# EAGLE design esp_prog (EAGLE 9.6.2)
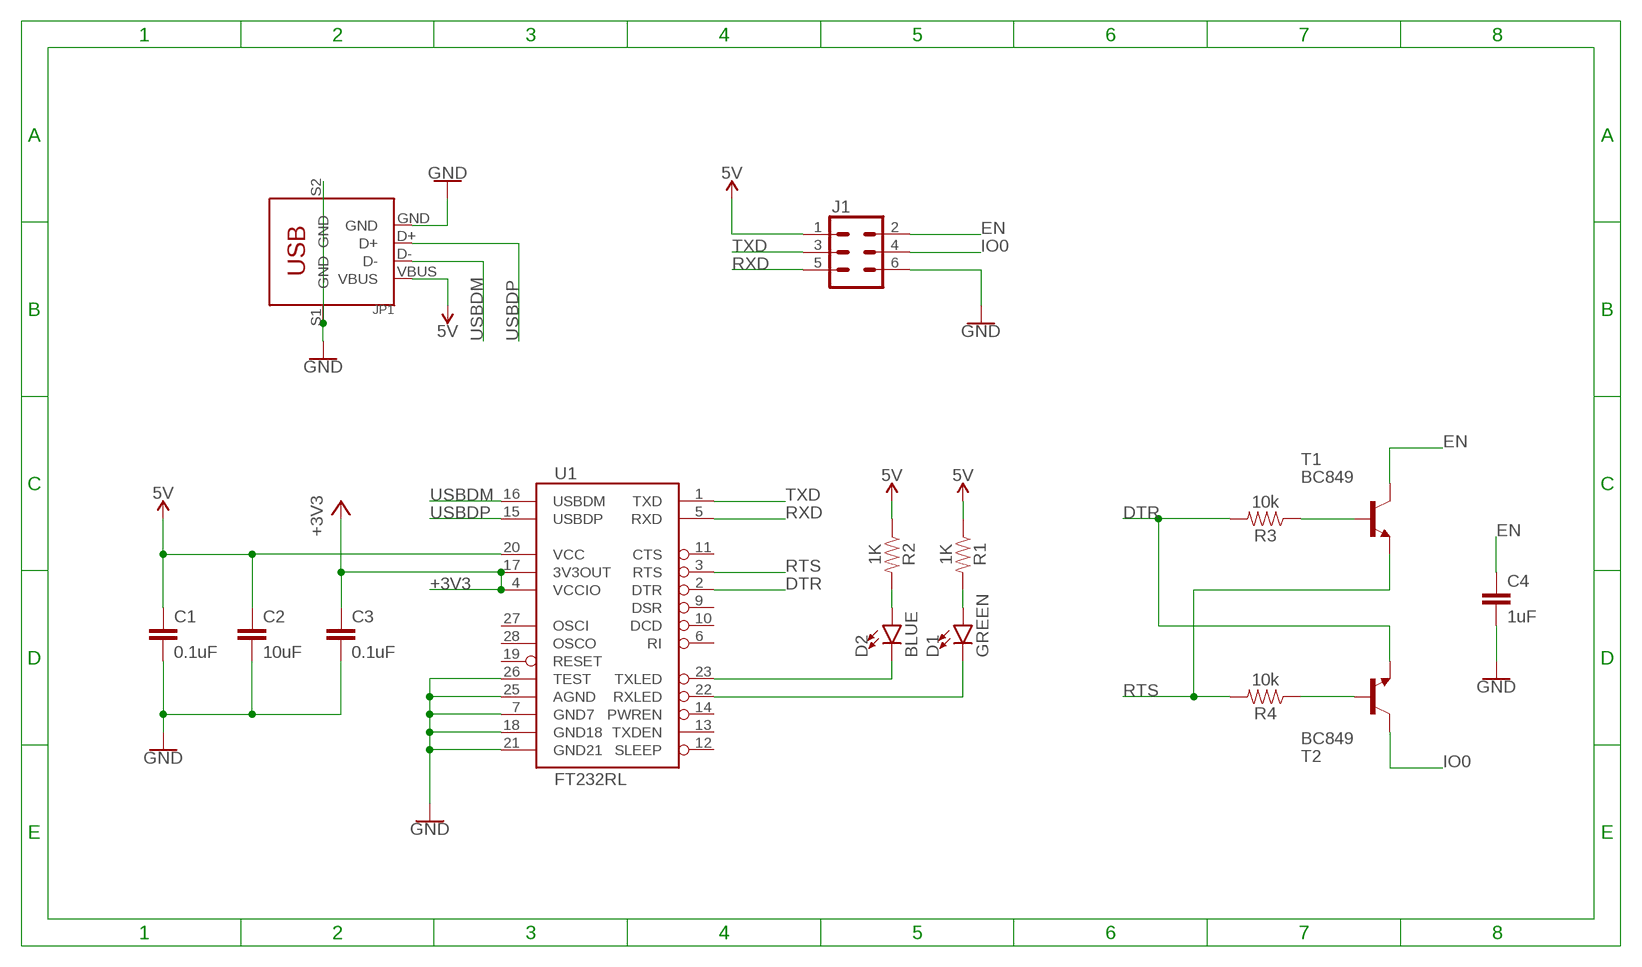
[diagram p0: schematic, sheet 1]

## Parts
C1  0.1uF  0.1UF-0603-25V-(+80/-20%)  [0603]
C2  10uF  10UF-0603-6.3V-20%  [0603]
C3  0.1uF  0.1UF-0603-25V-(+80/-20%)  [0603]
C4  1uF  10UF-0603-6.3V-20%  [0603]
D1  GREEN  LED-GREEN0603  [LED-0603]
D2  BLUE  LED-BLUE0603  [LED-0603]
J1  CONN_03X2SHROUD  [2X3-SHROUDED]
JP1  DIP-USB-B-TYPE-FMAL(4+2P-2.0-90D)  [USB4+2-2.5-90D-15.8X12MM]
R1  1K  RESISTOR0603  [0603]
R2  1K  RESISTOR0603  [0603]
R3  10k  RESISTOR0603  [0603]
R4  10k  RESISTOR0603  [0603]
T1  BC849  [SOT23]
T2  BC849  [SOT23]
U1  FT232RL  FT232RLSSOP  [SSOP28DB]

## Nets
5V: C1.1 C2.1 J1.1 JP1.VBUS R1.1 R2.1 U1.20(VCC)
+3V3: C3.1 U1.4(VCCIO) U1.17(3V3OUT)
DTR: R3.2 T2.2(E) U1.2(DTR)
EN: C4.1 J1.2 T1.3(C)
GND: C1.2 C2.2 C3.2 C4.2 J1.6 JP1.GND JP1.S1(GND) JP1.S2(GND) U1.7(GND7) U1.18(GND18) U1.21(GND21) U1.25(AGND) U1.26(TEST)
IO0: J1.4 T2.3(C)
N$1: D2.C U1.23(TXLED)
N$2: D1.C U1.22(RXLED)
N$3: D2.A R2.2
N$4: D1.A R1.2
N$5: R4.1 T2.1(B)
N$10: R3.1 T1.1(B)
RTS: R4.2 T1.2(E) U1.3(RTS)
RXD: J1.5 U1.5(RXD)
TXD: J1.3 U1.1(TXD)
USBDM: JP1.D- U1.16(USBDM)
USBDP: JP1.D+ U1.15(USBDP)
Unconnected: U1.6(RI) U1.9(DSR) U1.10(DCD) U1.11(CTS) U1.12(SLEEP) U1.13(TXDEN) U1.14(PWREN) U1.19(RESET) U1.27(OSCI) U1.28(OSCO)

## Library data of the parts
C1 C3 = SparkFun-Capacitors:0.1UF: 0.1µF ceramic capacitors A capacitor is a passive two-terminal electrical component used to store electrical energy temporarily in an electric field.; PROD_ID: CAP-00810
C2 = SparkFun-Capacitors:10UF: 10.0µF ceramic capacitors A capacitor is a passive two-terminal electrical component used to store electrical energy temporarily in an electric field.; PROD_ID: CAP-11015
C4 = SparkFun-Capacitors:10UF: 10.0µF ceramic capacitors A capacitor is a passive two-terminal electrical component used to store electrical energy temporarily in an electric field.; PROD_ID: CAP-11015; VALUE: 10uF
D1 = SparkFun-LED:LED-GREEN: Green SMD LED Used in manufacturing of various products at SparkFun Packages: 0603 - SMD 0603 package [Product Link] <http://www.futureelectronics.com/en/technologies/semiconductors/optoelectronics/leds/Pages/9894312-LTST-C190GKT.aspx?CrossPart=HSMG-C190&IM=0> LilyPad 1206 - SMD1206 LilyPad package [Product Link] <http://www.futureelectronics.com/en/Technologies/Product.aspx?ProductID=IN150NGHARVATEKCORPORATION2049943&IM=0> 1206 - SMD1206 package [Product Link] <http://www.futureelectronics.com/en/technologies/semiconductors/optoelectronics/leds/Pages/8315665-LTST-C150KGKT.aspx?IM=0> 1206 Bottom Mount -SMD 1206 Bottom Mount [Product Link] <http://www.digikey.com/product-detail/en/lite-on-inc/LTST-C230KGKT/160-1456-1-ND/386854> SparkFun Products: Pro Mini 328 -5V <https://www.sparkfun.com/products/821> RedBoard <https://www.sparkfun.com/products/12757> MP3 Trigger <https://www.sparkfun.com/products/13720> Makey Makey <https://www.sparkfun.com/products/11076>; PROD_ID: DIO-00821
D2 = SparkFun-LED:LED-BLUE: Blue SMD LED Used in manufacturing of various products at SparkFun Packages: 0603 - SMD 0603 package [Product Link] <http://www.digikey.com/product-detail/en/SMLE12BC7TT86/511-1589-2-ND/1641808> 1206 - SMD1206 package [Product Link] <http://www.digikey.com/product-detail/en/lite-on-inc/LTST-C150TBKT/160-1643-1-ND/573584> SparkFun Products: ESP8266 Thing-Dev Board <https://www.sparkfun.com/products/13711> RedBoard <https://www.sparkfun.com/products/12757>; PROD_ID: DIO-08575
J1 = SparkFun-Connectors:CONN_03X2: Multi connection point. Often used as Generic Header-pin footprint for 0.1 inch spaced/style header connections You can populate with any combo of single row headers, but if you'd like an exact match, check these: Header - 2x3 (Male, 0.1") <https://www.sparkfun.com/products/12807> (PRT-12807) Header - 2x3 (Female, 0.1") <https://www.sparkfun.com/products/13010> (PRT-13010) 2x3 Pin Shrouded Header <https://www.sparkfun.com/products/10877> (PRT-10877) On any of the 0.1 inch spaced packages, you can populate with these: Break Away Headers - Straight <https://www.sparkfun.com/products/116> (PRT-00116) Break Away Male Headers - Right Angle <https://www.sparkfun.com/products/553> (PRT-00553) Female Headers <https://www.sparkfun.com/products/115> (PRT-00115) Break Away Headers - Machine Pin <https://www.sparkfun.com/products/117> (PRT-00117) Break Away Female Headers - Swiss Machine Pin <https://www.sparkfun.com/products/743> (PRT-00743) Special note: the shrouded connector mates well with our 3x2 ribbon cables: Ribbon Crimp Connector - 6-pin (2x3, Female) <https://www.sparkfun.com/products/10651> (PRT-10651) Ribbon Cable - 6 wire (15ft) <https://www.sparkfun.com/products/10646> (PRT-10646); PROD_ID: CONN-10681; SF_ID: PRT_10877
JP1 = OPL_Connector:DIP-USB-B-TYPE-FMAL(4+2P-2.0-90D): 320010018
R1-R4 = SparkFun-Resistors:RESISTOR: Generic Resistor Package
T1 T2 = transistor:BC849: NPN TRANSISTOR
U1 = SparkFun-IC-Comms:FT232RL: FT232RL USB UART FT232RL 4th Generation USB UART (USB <-> Serial) Controller. Datasheet <http://www.sparkfun.com/datasheets/IC/FT232R_v104.pdf> SparkFun Products Component <https://www.sparkfun.com/products/650> (COM-00650) SparkFun RedBot Mainboard <https://www.sparkfun.com/products/12097> (ROB-12097) SparkFun FTDI Basic Breakout - 5V <https://www.sparkfun.com/products/9716> (DEV-09716) SparkFun FTDI Basic Breakout - 3.3V <https://www.sparkfun.com/products/9873> (DEV-09873) Bus Pirate - v3.6a <https://www.sparkfun.com/products/12942> (TOL-12942) SparkFun USB to Serial Breakout - FT232RL <https://www.sparkfun.com/products/12731> (BOB-12731) SparkFun PicoBoard <https://www.sparkfun.com/products/11888> (WIG-11888) SparkFun RFID USB Reader <https://www.sparkfun.com/products/9963> (SEN-09963) LilyPad FTDI Basic Breakout - 5V <https://www.sparkfun.com/products/10275> (DEV-10275) SparkFun Stepoko <https://www.sparkfun.com/products/13899> (ROB-13899); PROD_ID: IC-00870

## Board
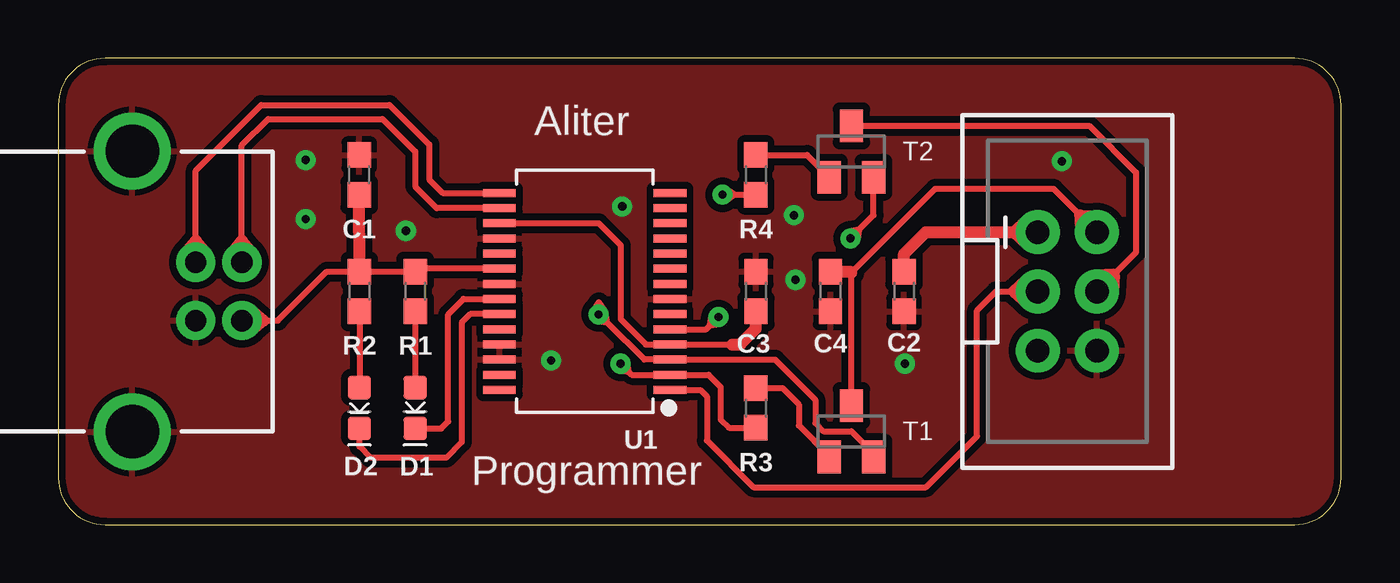
[diagram p1: board, top side]
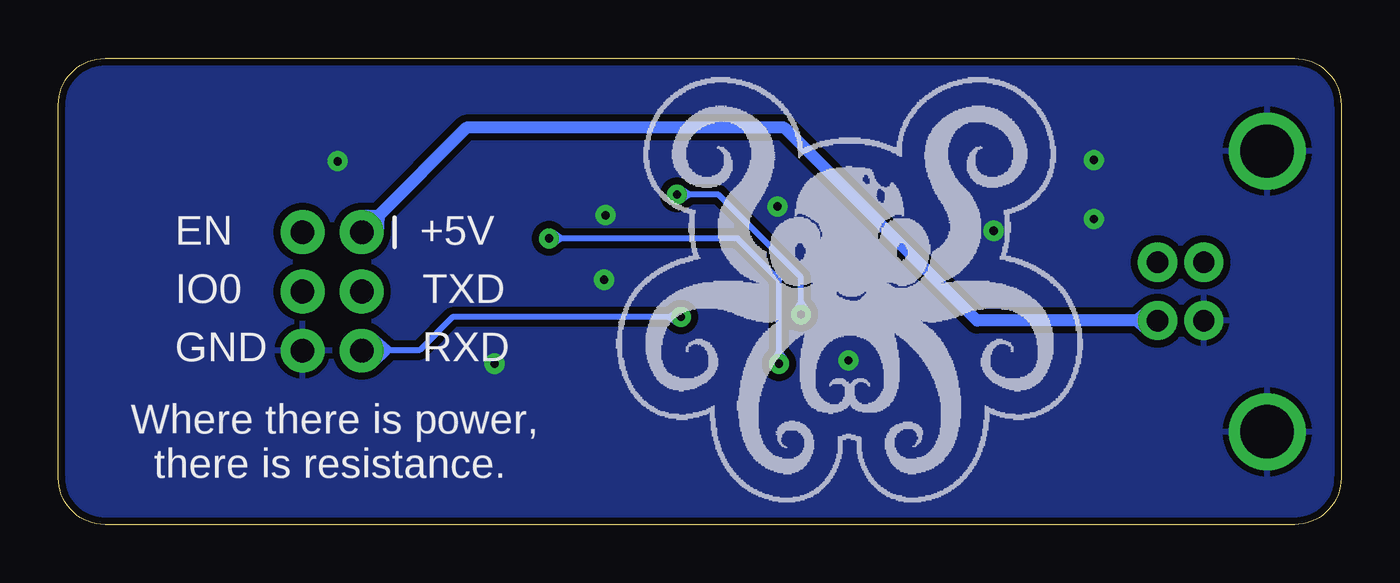
[diagram p2: board, bottom side, seen from below]

Size 55 x 20 mm. Coordinates in mm from the lower left corner, seen from the top.
Outline: 0,18 0,2 arc90 2,0 53,0 arc90 55,2 55,18 arc90 53,20 2,20 arc90 0,18
Copper layers (1*16): Top 0.035mm / dielectric 1.5mm / Bottom 0.035mm
Design rules "\Users\maruti\Documents\Hardware": minimum track width 10mil, minimum drill 20mil, track to track 10mil, track to pad 8mil, pad to pad 8mil, via to via 10mil, smd to smd 8mil, copper to edge 8mil, drill to drill 8mil, minimum pad ring 10mil, minimum via ring 10mil, stop-mask expansion 4mil, vias tented up to drill 25mil, thermal gap 10mil

### Footprints (pad centres in the part's own frame; a part is rotated, then mirrored left to right if it is on the bottom)
0603 = smd 1.1 x 1: 1 -0.85,0; 2 0.85,0
LED-0603 = smd 1 x 1: A -0.877,0; C 0.877,0
2X3-SHROUDED = drill 1.016 pad 1.88: 1 -1.27,2.54; 2 1.27,2.54; 3 -1.27,0; 4 1.27,0; 5 -1.27,-2.54; 6 1.27,-2.54
USB4+2-2.5-90D-15.8X12MM = drill 0.914 pad 1.676: D+ 0,1.25; D- 1.981,1.25; GND 0,-1.25; VBUS 1.981,-1.25 | drill 2.286: S1 -2.718,-6.02; S2 -2.718,6.02
SOT23 = smd 1 x 1.4: 1 -0.95,-1.1; 2 0.95,-1.1; 3 0,1.1
SSOP28DB = smd 0.348 x 1.397: 1 -4.225,-3.656; 2 -3.575,-3.656; 3 -2.925,-3.656; 4 -2.275,-3.656; 5 -1.625,-3.656; 6 -0.975,-3.656; 7 -0.325,-3.656; 8 0.325,-3.656; 9 0.975,-3.656; 10 1.625,-3.656; 11 2.275,-3.656; 12 2.925,-3.656; 13 3.575,-3.656; 14 4.225,-3.656; 15 4.225,3.656; 16 3.575,3.656; 17 2.925,3.656; 18 2.275,3.656; 19 1.625,3.656; 20 0.975,3.656; 21 0.325,3.656; 22 -0.325,3.656; 23 -0.975,3.656; 24 -1.625,3.656; 25 -2.275,3.656; 26 -2.925,3.656; 27 -3.575,3.656; 28 -4.225,3.656

### Placement (x,y rotation side)
C1  12.9,15 90 top
C2  36.26,10 270 top
C3  29.91,10 90 top
C4  33.1,10 270 top
D1  15.3,5 270 top
D2  12.91,5 270 top
J1  43.26,10 0 top
JP1  5.89,10 0 top
R1  15.3,10 270 top
R2  12.91,10 270 top
R3  29.9,5 270 top
R4  29.9,15 270 top
T1  34,4 0 top
T2  34,16 0 top
U1  22.57,10 90 top
U$2  [SFE_LUDUS-L]  21.1,9.3 0 bottom

### Tracks (layer width: path | path; a pad name or v marks a point on that pad's centre or on a via)
5V
  Top 0.254: JP1.VBUS 8.79,8.75 | 8.79,8.75 | 8.79,8.75 9.41,8.75 11.51,10.85 R2.1 R1.1 15.43,10.97 U1.20
  Top 0.508: 8.24,8.3 | JP1.VBUS 8.24,8.3 | R2.1 C1.1 | C2.1 36.26,11.61 37.19,12.54 40.97,12.54 | 40.97,12.54 J1.1 | 8.79,8.75 8.24,9.2 | 8.79,8.75 8.24,9.2 | 8.24,9.2 | JP1.VBUS 8.24,9.2 | 8.79,8.75 8.24,8.3 | JP1.VBUS 8.24,8.3 | 8.79,8.75 8.24,9.2 | JP1.VBUS 8.24,9.2 | 8.79,8.75 8.24,8.3 | JP1.VBUS 8.24,8.3 | 8.79,8.75 8.24,9.2 | 8.24,9.2 | 8.79,8.75 | 8.79,8.75 8.24,8.3 | JP1.VBUS 8.24,8.3 | 8.79,8.75 8.24,9.2 | JP1.VBUS 8.24,9.2 | 8.79,8.75 8.24,8.3 | JP1.VBUS 8.24,8.3 | 40.97,12.54 41.53,12.03 J1.1 | 40.97,12.54 41.53,13.05 J1.1
  Bottom 0.508: JP1.VBUS 8.79,8.75 | 8.79,8.75 15.61,8.75 23.88,17.02 37.51,17.02 41.27,13.26 | 41.27,13.26 J1.1 | 8.79,8.75 8.24,9.2 JP1.VBUS | 8.79,8.75 8.24,8.3 JP1.VBUS | 41.27,13.26 41.3,12.51 J1.1 | 41.27,13.26 42.02,13.22 J1.1
+3V3
  Top 0.254: 28.9,7.72 U1.4 25.19,7.72 24.11,8.81 24.11,11.99 23.17,12.93 U1.17
  Top 0.508: 28.9,7.72 29.23,7.72 29.91,8.41 C3.1
DTR  (via drill 0.35)
  Top 0.254: R3.2 28.75,4.15 28.4,4.5 28.4,5.9 27.88,6.42 U1.2 24.57,6.42 24.47,6.53 | v24.1,6.9 24.47,6.53 | v33.96,12.28 34.33,12.65 | 34.33,12.65 34.95,13.27 T2.2 | 24.47,6.53 24.34,6.97 v24.1,6.9 | 24.47,6.53 24.03,6.66 v24.1,6.9 | 34.33,12.65 33.89,12.52 v33.96,12.28 | 34.33,12.65 34.2,12.21 v33.96,12.28 | 24.47,6.53 24.4,6.95 v24.1,6.9 | 24.47,6.53 24.05,6.6 v24.1,6.9 | 34.33,12.65 33.91,12.57 v33.96,12.28 | 34.33,12.65 34.26,12.23 v33.96,12.28
  Bottom 0.254: v24.1,6.9 24.1,7.42 | 24.1,7.42 24.1,10.5 25.88,12.28 33.43,12.28 | 33.43,12.28 v33.96,12.28 | 24.1,7.42 23.88,7.02 | 24.32,7.02 | v24.1,6.9 24.32,7.02 | 33.43,12.28 33.84,12.06 | 33.84,12.5 | v33.96,12.28 33.84,12.5 | 23.88,7.02 | 23.88,7.02 | v24.1,6.9 23.88,7.02 | 24.1,7.42 23.88,7.02 | v24.1,6.9 23.88,7.02 | 24.1,7.42 | 24.1,7.42 24.32,7.02 | 24.32,7.02 | v24.1,6.9 24.32,7.02 | 24.1,7.42 23.88,7.02 | v24.1,6.9 23.88,7.02 | 24.1,7.42 | 24.1,7.42 24.32,7.02 | v24.1,6.9 24.32,7.02 | 33.84,12.06 | 33.84,12.06 | v33.96,12.28 33.84,12.06 | 33.43,12.28 33.84,12.06 | v33.96,12.28 33.84,12.06 | 33.43,12.28 | 33.43,12.28 33.84,12.5 | 33.84,12.5 | v33.96,12.28 33.84,12.5 | 33.43,12.28 33.84,12.06 | v33.96,12.28 33.84,12.06 | 33.43,12.28 | 33.43,12.28 33.84,12.5 | v33.96,12.28 33.84,12.5 | 24.1,7.42 24.35,7.07 | 33.43,12.28 33.78,12.53 | 24.1,7.42 23.85,7.07 | 23.85,7.07 | 24.1,7.42 24.35,7.07 | 24.35,7.07 | 24.35,7.07 | 24.1,7.42 23.85,7.07 | 23.85,7.07 | 23.85,7.07 | 24.1,7.42 | 24.1,7.42 23.85,7.07 | v24.1,6.9 23.85,7.07 | 24.1,7.42 24.35,7.07 | 24.35,7.07 | 24.1,7.42 | 24.1,7.42 23.85,7.07 | v24.1,6.9 23.85,7.07 | 24.1,7.42 | 24.1,7.42 24.35,7.07 | v24.1,6.9 24.35,7.07 | 24.1,7.42 23.85,7.07 | 24.1,7.42 23.85,7.07 | 23.85,7.07 | 24.1,7.42 23.85,7.07 | v24.1,6.9 23.85,7.07 | 24.1,7.42 24.35,7.07 | 24.35,7.07 | v24.1,6.9 24.35,7.07 | 24.1,7.42 24.35,7.07 | v24.1,6.9 24.35,7.07 | 24.1,7.42 23.85,7.07 | 24.1,7.42 24.35,7.07 | 24.1,7.42 23.85,7.07 | v24.1,6.9 23.85,7.07 | 24.1,7.42 24.35,7.07 | v24.1,6.9 24.35,7.07 | 33.43,12.28 33.78,12.03 | 33.78,12.03 | 33.43,12.28 33.78,12.53 | 33.78,12.53 | 33.78,12.53 | 33.43,12.28 33.78,12.03 | 33.78,12.03 | 33.78,12.03 | 33.43,12.28 | 33.43,12.28 33.78,12.03 | v33.96,12.28 33.78,12.03 | 33.43,12.28 33.78,12.53
  Bottom 0.254: 33.78,12.53 | 33.43,12.28 | 33.43,12.28 33.78,12.03 | v33.96,12.28 33.78,12.03 | 33.43,12.28 | 33.43,12.28 33.78,12.53 | v33.96,12.28 33.78,12.53 | 33.43,12.28 33.78,12.03 | 33.43,12.28 33.78,12.03 | 33.78,12.03 | 33.43,12.28 33.78,12.03 | v33.96,12.28 33.78,12.03 | 33.43,12.28 33.78,12.53 | 33.78,12.53 | v33.96,12.28 33.78,12.53 | 33.43,12.28 33.78,12.53 | v33.96,12.28 33.78,12.53 | 33.43,12.28 33.78,12.03 | 33.43,12.28 33.78,12.53 | 33.43,12.28 33.78,12.03 | v33.96,12.28 33.78,12.03 | 33.43,12.28 33.78,12.53 | v33.96,12.28 33.78,12.53
EN
  Top 0.254: J1.2 43.81,13.26 42.67,14.4 37.6,14.4 34,10.8 T1.3
  Top 0.508: C4.1 33.95,10.85 34,10.8 | 43.81,13.26 43.84,12.51 J1.2 44.56,13.22 43.81,13.26
GND  (via drill 0.35)
  other vias: 31.6,10.5 36.3,6.9 10.6,15.64 14.9,12.6 21.13,7.04 24.18,13.65 31.54,13.27 43.03,15.58 10.6,13.1
  pour Top (isolate 0.305): 0,0 55,0 55,20 0,20
  pour Bottom (isolate 0.305): 0,0 55,0 55,20 0,20
IO0
  Top 0.254: J1.4 45.25,10.72 46.2,11.67 46.2,15.1 44.2,17.1 T2.3
  Top 0.508: 45.25,10.72 44.5,10.69 J1.4 45.22,9.97 45.25,10.72
N$1
  Top 0.254: U1.23 17.66,9.03 17.3,8.66 17.3,3.53 16.64,2.87 13.39,2.87 12.91,3.35 D2.C
N$2
  Top 0.254: D1.C 16.42,4.12 16.71,4.42 16.71,9.02 17.37,9.68 U1.22
N$3
  Top 0.254: R2.2 D2.A
N$4
  Top 0.254: R1.2 D1.A
N$5
  Top 0.254: T2.1 32.1,15.85 R4.1
N$10
  Top 0.254: R3.1 31.05,5.85 31.75,5.15 31.75,4.25 33.05,2.95 T1.1
RTS  (via drill 0.35)
  Top 0.254: v23.16,9.02 23.18,9.02 23.55,8.65 | v28.47,14.15 v28.48,14.15 29,14.15 | 29,14.15 R4.2 | 23.55,8.65 25.12,7.08 U1.3 30.73,7.08 32.45,5.35 32.45,4.35 32.8,4 34,4 34.95,3.05 T1.2 | 23.55,8.65 | 23.55,8.65 23.4,9.09 | 23.55,8.65 | 23.55,8.65 23.1,8.77 | v23.16,9.02 23.1,8.77 | 23.16,9.54 22.94,9.14 v23.16,9.02 | 23.16,9.54 | 23.16,9.54 23.39,9.14 v23.16,9.02 | 23.55,8.65 23.4,9.09 | v23.16,9.02 23.4,9.09 | 23.55,8.65 23.1,8.77 | 23.55,8.65 23.4,9.09 | v23.16,9.02 23.4,9.09 | 23.55,8.65 23.1,8.77 | v23.16,9.02 23.1,8.77 | 29,14.15 28.59,14.37 v28.47,14.15 | 29,14.15 28.59,13.93 v28.47,14.15 | 23.55,8.65 | 23.55,8.65 23.12,8.72 | 23.12,8.72 | 23.16,9.54 22.92,9.19 | 22.92,9.19 | 23.16,9.54 23.41,9.19 | 23.41,9.19 | 23.55,8.65 23.46,9.08 | 23.46,9.08 | v23.16,9.02 23.46,9.08 | 23.55,8.65 23.12,8.72 | v23.16,9.02 23.12,8.72 | 23.41,9.19 | 23.16,9.54 22.92,9.19 | 22.92,9.19 | 22.92,9.19 | 23.16,9.54 | 23.16,9.54 22.92,9.19 | v23.16,9.02 22.92,9.19 | 23.16,9.54 23.41,9.19 | 23.41,9.19 | 23.16,9.54 | 23.16,9.54 22.92,9.19 | v23.16,9.02 22.92,9.19 | 23.16,9.54 | 23.16,9.54 23.41,9.19 | v23.16,9.02 23.41,9.19 | 23.16,9.54 22.92,9.19 | 23.16,9.54 22.92,9.19 | 22.92,9.19 | 23.16,9.54 23.41,9.19 | 23.16,9.54 22.92,9.19 | v23.16,9.02 22.92,9.19 | 23.16,9.54 23.41,9.19 | 23.41,9.19 | v23.16,9.02 23.41,9.19 | 23.16,9.54 22.92,9.19 | 23.16,9.54 23.41,9.19 | v23.16,9.02 23.41,9.19 | 23.16,9.54 22.92,9.19 | v23.16,9.02 22.92,9.19 | 23.16,9.54 23.41,9.19 | v23.16,9.02 23.41,9.19 | 23.55,8.65 23.46,9.08 | v23.16,9.02 23.46,9.08 | 23.55,8.65 23.12,8.72 | v23.16,9.02 23.12,8.72 | 29,14.15 28.65,14.4 v28.47,14.15 | 29,14.15 28.65,13.9 v28.47,14.15
  Bottom 0.254: v23.16,9.02 23.16,9.54 | 23.16,9.54 23.16,10.62 26.7,14.15 27.95,14.15 | 27.95,14.15 v28.47,14.15 | 23.16,9.54 22.94,9.14 | 23.39,9.14 | v23.16,9.02 23.39,9.14 | 27.95,14.15 28.35,13.93 | 28.35,14.37 | v28.47,14.15 28.35,14.37 | 22.94,9.14 | 22.94,9.14 | v23.16,9.02 22.94,9.14 | 23.16,9.54 22.94,9.14 | v23.16,9.02 22.94,9.14 | 23.16,9.54 | 23.16,9.54 23.39,9.14 | 23.39,9.14 | v23.16,9.02 23.39,9.14 | 23.16,9.54 22.94,9.14 | v23.16,9.02 22.94,9.14 | 23.16,9.54 | 23.16,9.54 23.39,9.14 | v23.16,9.02 23.39,9.14 | 28.35,13.93 | 28.35,13.93 | v28.47,14.15 28.35,13.93 | 27.95,14.15 28.35,13.93 | v28.47,14.15 28.35,13.93 | 27.95,14.15 | 27.95,14.15 28.35,14.37 | 28.35,14.37 | v28.47,14.15 28.35,14.37 | 27.95,14.15 28.35,13.93 | v28.47,14.15 28.35,13.93 | 27.95,14.15 | 27.95,14.15 28.35,14.37 | v28.47,14.15 28.35,14.37 | 23.16,9.54 23.41,9.19 | 27.95,14.15 28.3,14.39 | 23.16,9.54 22.92,9.19 | 22.92,9.19 | 23.16,9.54 23.41,9.19 | 23.41,9.19 | 23.41,9.19 | 23.16,9.54 22.92,9.19 | 22.92,9.19 | 22.92,9.19 | 23.16,9.54 | 23.16,9.54 22.92,9.19 | v23.16,9.02 22.92,9.19 | 23.16,9.54 23.41,9.19 | 23.41,9.19 | 23.16,9.54 | 23.16,9.54 22.92,9.19 | v23.16,9.02 22.92,9.19 | 23.16,9.54 | 23.16,9.54 23.41,9.19 | v23.16,9.02 23.41,9.19 | 23.16,9.54 22.92,9.19 | 23.16,9.54 22.92,9.19 | 22.92,9.19 | 23.16,9.54 22.92,9.19 | v23.16,9.02 22.92,9.19 | 23.16,9.54 23.41,9.19 | 23.41,9.19 | v23.16,9.02 23.41,9.19 | 23.16,9.54 23.41,9.19 | v23.16,9.02 23.41,9.19 | 23.16,9.54 22.92,9.19 | 23.16,9.54 23.41,9.19 | 23.16,9.54 22.92,9.19 | v23.16,9.02 22.92,9.19 | 23.16,9.54 23.41,9.19 | v23.16,9.02 23.41,9.19 | 27.95,14.15 28.3,13.9 | 28.3,13.9 | 27.95,14.15 28.3,14.39 | 28.3,14.39 | 28.3,14.39 | 27.95,14.15 28.3,13.9 | 28.3,13.9 | 28.3,13.9 | 27.95,14.15 | 27.95,14.15 28.3,13.9
  Bottom 0.254: v28.47,14.15 28.3,13.9 | 27.95,14.15 28.3,14.39 | 28.3,14.39 | 27.95,14.15 | 27.95,14.15 28.3,13.9 | v28.47,14.15 28.3,13.9 | 27.95,14.15 | 27.95,14.15 28.3,14.39 | v28.47,14.15 28.3,14.39 | 27.95,14.15 28.3,13.9 | 27.95,14.15 28.3,13.9 | 28.3,13.9 | 27.95,14.15 28.3,13.9 | v28.47,14.15 28.3,13.9 | 27.95,14.15 28.3,14.39 | 28.3,14.39 | v28.47,14.15 28.3,14.39 | 27.95,14.15 28.3,14.39 | v28.47,14.15 28.3,14.39 | 27.95,14.15 28.3,13.9 | 27.95,14.15 28.3,14.39 | 27.95,14.15 28.3,13.9 | v28.47,14.15 28.3,13.9 | 27.95,14.15 28.3,14.39 | v28.47,14.15 28.3,14.39
RXD  (via drill 0.35)
  Top 0.254: U1.5 27.77,8.38 27.93,8.53 | 27.93,8.53 v28.3,8.9 | 27.93,8.53 28.35,8.6 v28.3,8.9 | 27.93,8.53 28,8.95 v28.3,8.9
  Bottom 0.254: v28.3,8.9 28.82,8.9 | 28.82,8.9 | 28.82,8.9 38.1,8.9 39.5,7.5 40.98,7.5 41.95,7.5 J1.5 | 28.82,8.9 28.47,8.65 | 28.47,8.65 | 28.82,8.9 28.47,9.15 | 28.47,9.15 | 28.82,8.9 28.47,8.65 | 28.47,8.65 | 28.82,8.9 28.47,9.15 | 28.47,9.15 | v28.3,8.9 28.47,9.15 | 28.82,8.9 28.47,8.65 | v28.3,8.9 28.47,8.65 | 28.47,8.65 | 28.82,8.9 28.47,9.15 | v28.3,8.9 28.47,9.15 | 28.82,8.9 28.47,8.65 | 28.47,8.65 | v28.3,8.9 28.47,8.65 | 28.82,8.9 28.47,9.15 | v28.3,8.9 28.47,9.15 | 28.82,8.9 | 28.82,8.9 28.47,8.65 | v28.3,8.9 28.47,8.65 | 28.82,8.9 28.47,9.15 | v28.3,8.9 28.47,9.15 | 28.82,8.9 28.47,8.65 | v28.3,8.9 28.47,8.65
  Bottom 0.508: 40.98,7.5 41.51,6.97 J1.5 41.55,7.98 40.98,7.5
TXD
  Top 0.254: U1.1 27.52,5.78 27.8,5.5 27.8,3.6 29.8,1.6 37.2,1.6 39.39,3.79 39.39,9.19 40.2,10 40.97,10 | 40.97,10 | 40.97,10 J1.3
  Top 0.508: 40.97,10 | 40.97,10 41.53,9.49 | 40.97,10 41.53,10.51 | 40.97,10 41.53,9.49 | J1.3 41.53,9.49 | 40.97,10 41.53,10.51 | J1.3 41.53,10.51 | 40.97,10 41.53,9.49 | J1.3 41.53,9.49 | 40.97,10 41.53,10.51 | J1.3 41.53,10.51
USBDM
  Top 0.254: U1.16 16.23,13.57 15.3,14.5 15.3,16 13.9,17.4 9,17.4 7.87,16.27 7.87,12.16 | JP1.D- 7.87,12.16 | 7.87,12.16
  Top 0.508: 7.87,12.16 | 7.87,12.16 7.42,11.62 | JP1.D- 7.42,11.62 | 7.87,12.16 8.32,11.62 | JP1.D- 8.32,11.62 | 7.87,12.16 7.42,11.62 | JP1.D- 7.42,11.62 | 7.87,12.16 8.32,11.62 | JP1.D- 8.32,11.62 | 7.87,12.16 7.42,11.62 | JP1.D- 7.42,11.62 | 7.87,12.16 8.32,11.62 | JP1.D- 8.32,11.62
USBDP
  Top 0.254: U1.15 16.48,14.22 15.9,14.8 15.9,16.3 14.2,18 8.7,18 5.89,15.19 5.89,12.16 | JP1.D+ 5.89,12.16 | 5.89,12.16
  Top 0.508: 5.89,12.16 | 5.89,12.16 5.44,11.62 | JP1.D+ 5.44,11.62 | 5.89,12.16 6.34,11.62 | JP1.D+ 6.34,11.62 | 5.89,12.16 5.44,11.62 | JP1.D+ 5.44,11.62 | 5.89,12.16 6.34,11.62 | JP1.D+ 6.34,11.62 | 5.89,12.16 5.44,11.62 | JP1.D+ 5.44,11.62 | 5.89,12.16 6.34,11.62 | JP1.D+ 6.34,11.62

### Text on the board
tNames: Aliter | Programmer
bNames: +5V | EN | TXD | IO0 | RXD | GND | Where there is power, | there is resistance.